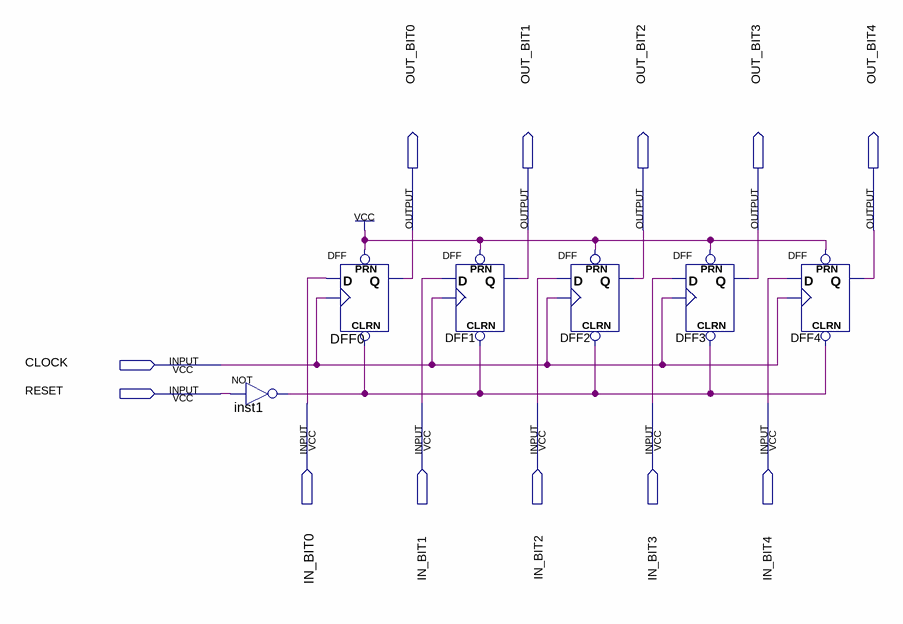
[diagram p0: schematic sheet]
// Quartus schematic 5BIT_Register.bdf as structural Verilog: 6 symbols, 12 pins
module \5BIT_Register  (
  input  CLOCK,
  input  RESET,
  input  IN_BIT0,
  input  IN_BIT1,
  input  IN_BIT2,
  input  IN_BIT3,
  input  IN_BIT4,
  output OUT_BIT0,
  output OUT_BIT1,
  output OUT_BIT2,
  output OUT_BIT3,
  output OUT_BIT4
);

  wire inst1_out;

  not inst1 (inst1_out, RESET);
  DFF DFF0 (.CLRN(inst1_out), .CLK(CLOCK), .D(IN_BIT0), .PRN(1'b1), .Q(OUT_BIT0));
  DFF DFF1 (.CLRN(inst1_out), .CLK(CLOCK), .D(IN_BIT1), .PRN(1'b1), .Q(OUT_BIT1));
  DFF DFF2 (.CLRN(inst1_out), .CLK(CLOCK), .D(IN_BIT2), .PRN(1'b1), .Q(OUT_BIT2));
  DFF DFF3 (.CLRN(inst1_out), .CLK(CLOCK), .D(IN_BIT3), .PRN(1'b1), .Q(OUT_BIT3));
  DFF DFF4 (.CLRN(inst1_out), .CLK(CLOCK), .D(IN_BIT4), .PRN(1'b1), .Q(OUT_BIT4));
endmodule
